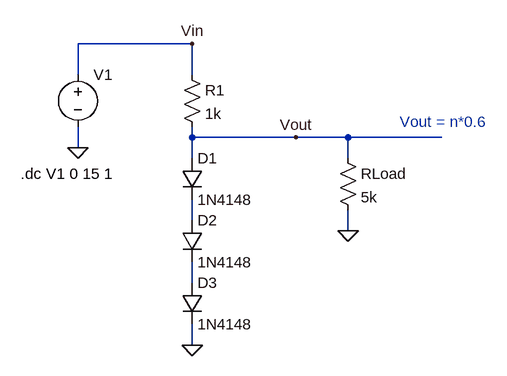
[diagram p0: schematic smallSigna_voltReg.asc]
smallSigna_voltReg.asc, the LTspice schematic file:
Version 4
SHEET 1 880 680
WIRE 80 64 -96 64
WIRE -96 112 -96 64
WIRE 80 112 80 64
WIRE 80 208 80 192
WIRE 240 208 80 208
WIRE 320 208 240 208
WIRE 464 208 320 208
WIRE -96 224 -96 192
WIRE 80 240 80 208
WIRE 320 240 320 208
WIRE 80 336 80 304
WIRE 320 352 320 320
WIRE 80 432 80 400
WIRE 80 528 80 496
FLAG 320 352 0
FLAG 80 528 0
FLAG -96 224 0
FLAG 80 64 Vin
FLAG 240 208 Vout
SYMBOL res 64 96 R0
SYMATTR InstName R1
SYMATTR Value 1k
SYMBOL diode 64 240 R0
SYMATTR InstName D1
SYMATTR Value 1N4148
SYMBOL diode 64 336 R0
SYMATTR InstName D2
SYMATTR Value 1N4148
SYMBOL diode 64 432 R0
SYMATTR InstName D3
SYMATTR Value 1N4148
SYMBOL res 304 224 R0
SYMATTR InstName RLoad
SYMATTR Value 5k
SYMBOL voltage -96 96 R0
WINDOW 123 0 0 Left 0
WINDOW 39 0 0 Left 0
SYMATTR InstName V1
SYMATTR Value ""
TEXT 400 184 Left 2 ;Vout = n*0.6
TEXT -184 264 Left 2 !.dc V1 0 15 1

The netlist it stands for:
* smallSigna_voltReg.asc
R1 Vin Vout 1k
D1 Vout N001 1N4148
D2 N001 N002 1N4148
D3 N002 0 1N4148
RLoad Vout 0 5k
V1 Vin 0
.model D D
.lib standard.dio
* Vout = n*0.6
.dc V1 0 15 1
.backanno
.end